# Altium schematic sheet Core_1.SchDoc
size A4
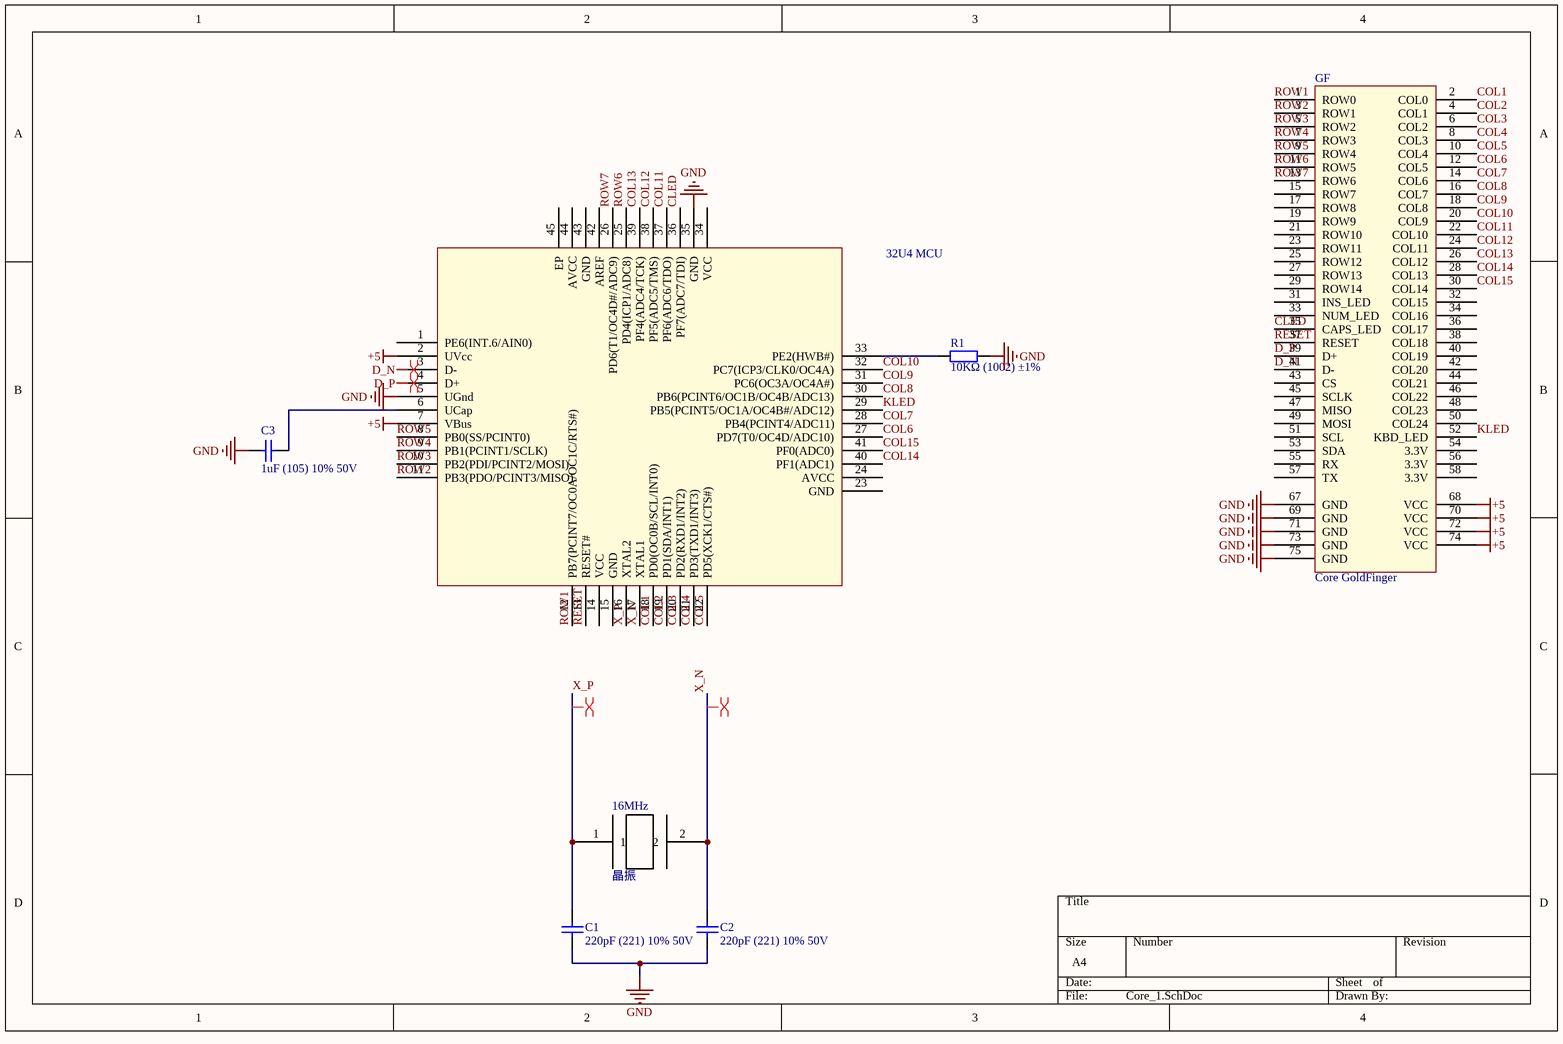
[diagram p0: Core_1.SchDoc]

## Parts
16MHz  晶振  [OSC-SMD_2P-L5.0-W3.2]
?  32U4 MCU  [32U4]
C1  220pF (221) 10% 50V  [1206_C]
C2  220pF (221) 10% 50V  [1206_C]
C3  1uF (105) 10% 50V  [1206_C]
GF  Core GoldFinger  [Core GoldFinger]
R1  10KΩ (1002) ±1%  [1206_R]

## Nets
+5: ?.2(UVcc) ?.7(VBus) GF.68(VCC) GF.70(VCC) GF.72(VCC) GF.74(VCC)
GND: ?.5(UGnd) ?.35(GND) C1.2 C2.2 C3.1 GF.67(GND) GF.69(GND) GF.71(GND) GF.73(GND) GF.75(GND) R1.2
CLED: ?.36(PF7(ADC7/TDI)) GF.35(CAPS_LED)
COL1: ?.18(PD0(OC0B/SCL/INT0)) GF.2(COL0)
COL2: ?.19(PD1(SDA/INT1)) GF.4(COL1)
COL3: ?.20(PD2(RXD1/INT2)) GF.6(COL2)
COL4: ?.21(PD3(TXD1/INT3)) GF.8(COL3)
COL5: ?.22(PD5(XCK1/CTS#)) GF.10(COL4)
COL6: ?.27(PD7(T0/OC4D/ADC10)) GF.12(COL5)
COL7: ?.28(PB4(PCINT4/ADC11)) GF.14(COL6)
COL8: ?.30(PB6(PCINT6/OC1B/OC4B/ADC13)) GF.16(COL7)
COL9: ?.31(PC6(OC3A/OC4A#)) GF.18(COL8)
COL10: ?.32(PC7(ICP3/CLK0/OC4A)) GF.20(COL9)
COL11: ?.37(PF6(ADC6/TDO)) GF.22(COL10)
COL12: ?.38(PF5(ADC5/TMS)) GF.24(COL11)
COL13: ?.39(PF4(ADC4/TCK)) GF.26(COL12)
COL14: ?.40(PF1(ADC1)) GF.28(COL13)
COL15: ?.41(PF0(ADC0)) GF.30(COL14)
D_N: ?.3(D-) GF.41(D-)
D_P: ?.4(D+) GF.39(D+)
KLED: ?.29(PB5(PCINT5/OC1A/OC4B#/ADC12)) GF.52(KBD_LED)
RESET: ?.13(RESET#) GF.37(RESET)
ROW1: ?.12(PB7(PCINT7/OC0A/OC1C/RTS#)) GF.1(ROW0)
ROW2: ?.11(PB3(PDO/PCINT3/MISO)) GF.3(ROW1)
ROW3: ?.10(PB2(PDI/PCINT2/MOSI)) GF.5(ROW2)
ROW4: ?.9(PB1(PCINT1/SCLK)) GF.7(ROW3)
ROW5: ?.8(PB0(SS/PCINT0)) GF.9(ROW4)
ROW6: ?.25(PD4(ICP1/ADC8)) GF.11(ROW5)
ROW7: ?.26(PD6(T1/OC4D#/ADC9)) GF.13(ROW6)
X_N: 16MHz.2 ?.17(XTAL1) C2.1
X_P: 16MHz.1 ?.16(XTAL2) C1.1
Net?_6: ?.6(UCap) C3.2
Net?_33: ?.33(PE2(HWB#)) R1.1

Not connected (* = marked no-connect by the designer): ? 1(PE6(INT.6/AIN0)) 14(VCC) 15(GND) 23(GND) 24(AVCC) 34(VCC) 42(AREF) 43(GND) 44(AVCC) 45(EP); GF 15(ROW7) 17(ROW8) 19(ROW9) 21(ROW10) 23(ROW11) 25(ROW12) 27(ROW13) 29(ROW14) 31(INS_LED) 32(COL15) 33(NUM_LED) 34(COL16) 36(COL17) 38(COL18) 40(COL19) 42(COL20) 43(CS) 44(COL21) 45(SCLK) 46(COL22) 47(MISO) 48(COL23) 49(MOSI) 50(COL24) 51(SCL) 53(SDA) 54(3.3V) 55(RX) 56(3.3V) 57(TX) 58(3.3V)

## Layout directives
differential pair: D_N, D_P, X_N, X_P

## Library data of the parts
C1 C2 = 1206 220pF (221) 10% 50V: 贴片电容; ComponentLink1Description: 供应商链接; ComponentLink1URL: http://www.szlcsc.com/product/details_2206.html; Package: 1206; Supplier: LC; SuppliersPartNumber: C1854
C3 = 1206 1uF (105) 10% 50V: 贴片电容; ComponentLink1Description: 供应商链接; ComponentLink1URL: http://www.szlcsc.com/product/details_2200.html; Package: 1206; Supplier: LC; SuppliersPartNumber: C1848
R1 = 1206 10KΩ (1002) 1%: 贴片电阻; ComponentLink1Description: 供应商链接; ComponentLink1URL: http://www.szlcsc.com/product/details_18590.html; Package: 1206; Supplier: LC; SuppliersPartNumber: C17902